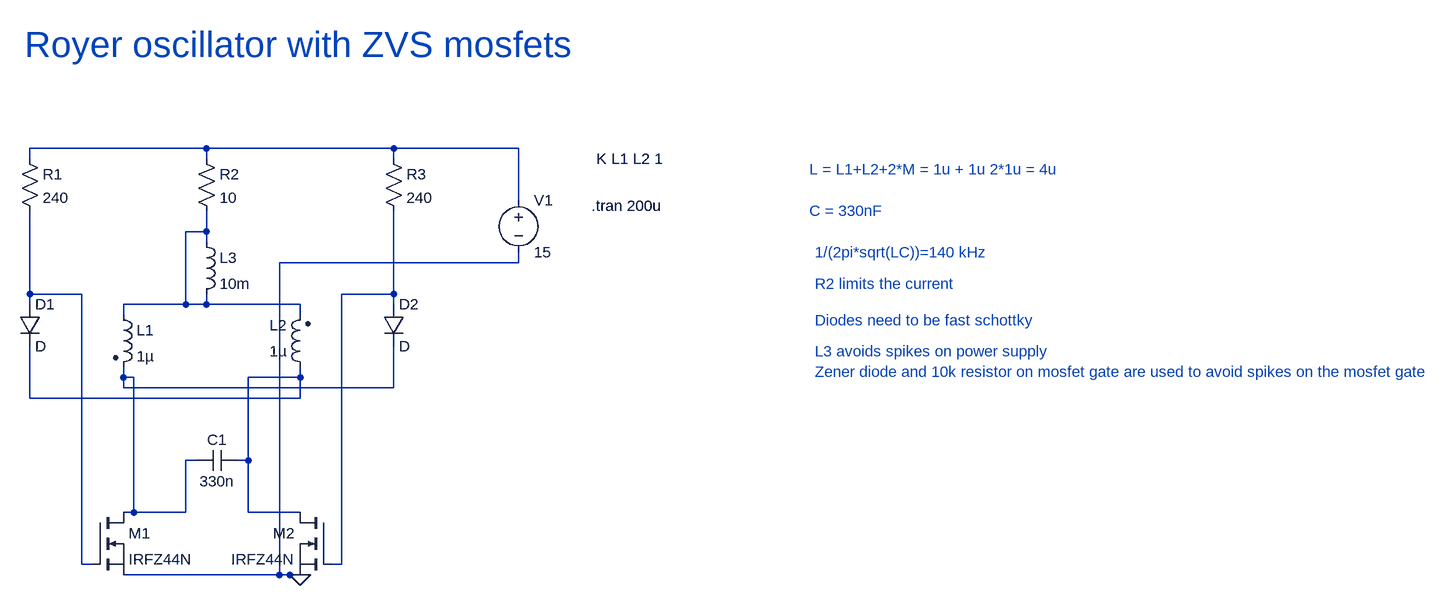
[diagram p0: schematic Royer-zvs.asc]
Royer-zvs.asc, the LTspice schematic file:
Version 4.1
SHEET 1 2304 788
WIRE 144 672 160 672
WIRE 416 672 400 672
WIRE 752 176 752 192
WIRE 160 672 400 672
WIRE 400 672 384 672
WIRE 384 672 384 192
WIRE 384 192 752 192
FLAG 416 672 0
WIRE 0 32 0 16
WIRE 272 32 272 16
WIRE 560 32 560 16
WIRE 752 96 752 80
WIRE 0 16 272 16
WIRE 272 16 560 16
WIRE 560 16 752 16
WIRE 752 16 752 80
WIRE 144 272 144 256
WIRE 416 272 416 256
WIRE 272 160 272 144
WIRE 272 240 272 256
WIRE 272 112 272 128
WIRE 144 256 272 256
WIRE 272 256 240 256
WIRE 240 256 240 144
WIRE 240 144 272 144
WIRE 272 144 272 128
WIRE 272 256 416 256
WIRE 0 256 0 240
WIRE 96 656 80 656
WIRE 0 112 0 128
WIRE 0 240 0 128
WIRE 0 240 80 240
WIRE 80 240 80 656
WIRE 560 256 560 240
WIRE 464 656 480 656
WIRE 560 112 560 128
WIRE 560 240 560 128
WIRE 560 240 480 240
WIRE 480 240 480 656
WIRE 256 496 240 496
WIRE 560 320 560 336
WIRE 144 352 144 368
WIRE 144 576 160 576
WIRE 240 496 240 576
WIRE 240 576 160 576
WIRE 160 576 160 368
WIRE 160 368 144 368
WIRE 144 368 144 384
WIRE 144 384 560 384
WIRE 560 384 560 336
WIRE 320 496 336 496
WIRE 0 320 0 336
WIRE 416 352 416 368
WIRE 416 576 400 576
WIRE 336 496 336 576
WIRE 336 576 400 576
WIRE 336 496 336 368
WIRE 336 368 416 368
WIRE 416 368 416 400
WIRE 416 400 0 400
WIRE 0 400 0 336
SYMBOL res -16 16 R0
SYMATTR InstName R1
SYMATTR Value 240
SYMBOL res 256 16 R0
SYMATTR InstName R2
SYMATTR Value 10
SYMBOL res 544 16 R0
SYMATTR InstName R3
SYMATTR Value 240
SYMBOL ind2 128 256 R0
SYMATTR InstName L1
SYMATTR Value 1µ
SYMATTR Type ind
SYMBOL ind2 432 368 R180
WINDOW 0 36 80 Left 2
WINDOW 3 36 40 Left 2
SYMATTR InstName L2
SYMATTR Value 1µ
SYMATTR Type ind
SYMBOL ind 256 144 R0
SYMATTR InstName L3
SYMATTR Value 10m
SYMBOL cap 320 480 R90
WINDOW 0 0 32 VBottom 2
WINDOW 3 32 32 VTop 2
SYMATTR InstName C1
SYMATTR Value 330n
SYMBOL diode -16 256 R0
SYMATTR InstName D1
SYMBOL diode 544 256 R0
SYMATTR InstName D2
SYMBOL nmos 96 576 R0
SYMATTR InstName M1
SYMATTR Value IRFZ44N
SYMBOL nmos 464 576 M0
SYMATTR InstName M2
SYMATTR Value IRFZ44N
SYMBOL voltage 752 80 R0
WINDOW 123 0 0 Left 0
WINDOW 39 0 0 Left 0
SYMATTR InstName V1
SYMATTR Value 15
TEXT 864 104 Left 2 !.tran 200u
TEXT 872 32 Left 2 !K L1 L2 1
TEXT 1200 48 Left 2 ;L = L1+L2+2*M = 1u + 1u 2*1u = 4u
TEXT 1200 112 Left 2 ;C = 330nF
TEXT 1208 176 Left 2 ;1/(2pi*sqrt(LC))=140 kHz
TEXT 1208 224 Left 2 ;R2 limits the current
TEXT -8 -144 Left 5 ;Royer oscillator with ZVS mosfets
TEXT 1208 280 Left 2 ;Diodes need to be fast schottky
TEXT 1208 328 Left 2 ;L3 avoids spikes on power supply\nZener diode and 10k resistor on mosfet gate are used to avoid spikes on the mosfet gate

The netlist it stands for:
* Royer-zvs.asc
R1 N001 N003 240
R2 N001 N002 10
R3 N001 N004 240
L1 N002 N005 1µ
L2 N006 N002 1µ
L3 N002 N002 10m
C1 N006 N005 330n
D1 N003 N006 D
D2 N004 N005 D
M1 N005 N003 0 0 IRFZ44N
M2 N006 N004 0 0 IRFZ44N
V1 N001 0 15
.model D D
.lib standard.dio
.model NMOS NMOS
.model PMOS PMOS
.lib standard.mos
.tran 200u
K L1 L2 1
* L = L1+L2+2*M = 1u + 1u 2*1u = 4u
* C = 330nF
* 1/(2pi*sqrt(LC))=140 kHz
* R2 limits the current
* Royer oscillator with ZVS mosfets
* Diodes need to be fast schottky
* L3 avoids spikes on power supply
* Zener diode and 10k resistor on mosfet gate are used to avoid spikes on the mosfet gate
.backanno
.end